# Altium schematic sheet Morpheus_pill.SchDoc: Pill
size Letter; DrawnBy: Dyke Shaffer; Organization: Hello Inc.; Revision: EVT2; SheetNumber: 1; SheetTotal: 4
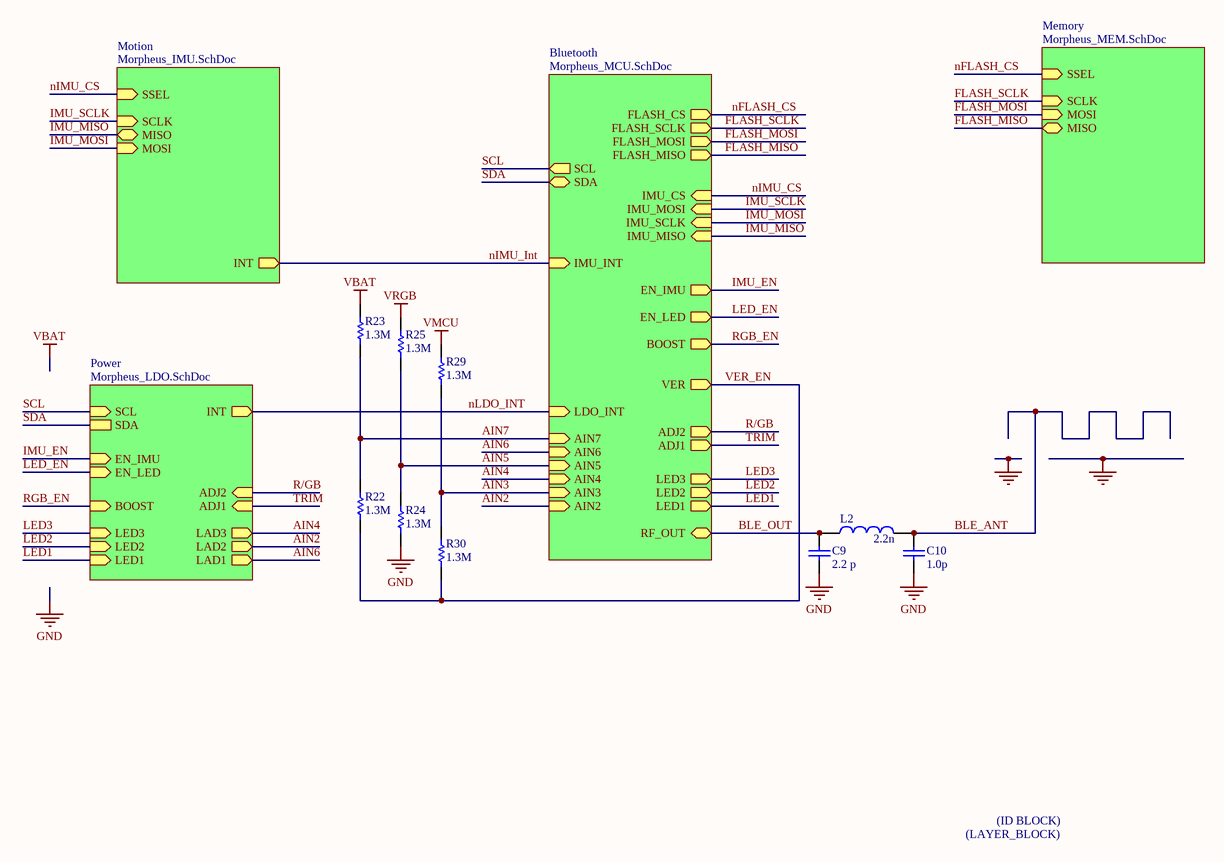
[diagram p0: Morpheus_pill.SchDoc]

## Parts
*  LAYER_BLOCK  [Layer Stackup]  (value not drawn)  (no BOM)
C9  2.2 p  [CAP0402]
C10  1.0p  [CAP0402]
ID1  ID_BLOCK  [Hello Band]  (value not drawn)  (no BOM)
L2  2.2n  [IND_0402]
R22  1.3M  [RES0402]
R23  1.3M  [RES0402]
R24  1.3M  [RES0402]
R25  1.3M  [RES0402]
R29  1.3M  [RES0402]
R30  1.3M  [RES0402]

## Sub-sheets
Bluetooth = Morpheus_MCU.SchDoc: FLASH_SCLK (out), FLASH_CS (out), IMU_INT (in), LED3 (out), EN_IMU (out), AIN6 (in), LDO_INT (in), SCL (out), SDA, AIN7 (in), EN_LED (out), AIN4 (in), AIN5 (in), AIN2 (in), AIN3 (in), RF_OUT, ADJ2 (out), ADJ1 (out), LED2 (out), LED1 (out), BOOST (out), VER (out), IMU_MISO (in), IMU_SCLK (in), IMU_MOSI (in), IMU_CS (in), FLASH_MOSI (out), FLASH_MISO (out)
Memory = Morpheus_MEM.SchDoc: SSEL (in), MOSI (in), MISO, SCLK (in)
Motion = Morpheus_IMU.SchDoc: MOSI (in), MISO, SCLK (in), INT (out), SSEL (in)
Power = Morpheus_LDO.SchDoc: SDA, INT (out), SCL (in), LAD3 (out), LAD2 (out), LAD1 (out), ADJ2 (in), EN_LED (in), EN_IMU (in), BOOST (in), ADJ1 (in), LED3 (in), LED2 (in), LED1 (in)

## Nets
GND: C9.2 C10.2 R24.1
VBAT: R23.2
VMCU: R29.2
VRGB: R25.2
AIN2: sheet Bluetooth/AIN2, sheet Power/LAD2
AIN3: R29.1 R30.2 ; sheet Bluetooth/AIN3
AIN4: sheet Bluetooth/AIN4, sheet Power/LAD3
AIN5: R24.2 R25.1 ; sheet Bluetooth/AIN5
AIN6: sheet Bluetooth/AIN6, sheet Power/LAD1
AIN7: R22.2 R23.1 ; sheet Bluetooth/AIN7
BLE_ANT: C10.1 L2.2
BLE_OUT: C9.1 L2.1 ; sheet Bluetooth/RF_OUT
FLASH_MISO: sheet Bluetooth/FLASH_MISO, sheet Memory/MISO
FLASH_MOSI: sheet Bluetooth/FLASH_MOSI, sheet Memory/MOSI
FLASH_SCLK: sheet Bluetooth/FLASH_SCLK, sheet Memory/SCLK
IMU_EN: sheet Bluetooth/EN_IMU, sheet Power/EN_IMU
IMU_MISO: sheet Bluetooth/IMU_MISO, sheet Motion/MISO
IMU_MOSI: sheet Bluetooth/IMU_SCLK, sheet Motion/MOSI
IMU_SCLK: sheet Bluetooth/IMU_MOSI, sheet Motion/SCLK
LED1: sheet Bluetooth/LED1, sheet Power/LED1
LED2: sheet Bluetooth/LED2, sheet Power/LED2
LED3: sheet Bluetooth/LED3, sheet Power/LED3
LED_EN: sheet Bluetooth/EN_LED, sheet Power/EN_LED
nFLASH_CS: sheet Bluetooth/FLASH_CS, sheet Memory/SSEL
nIMU_CS: sheet Bluetooth/IMU_CS, sheet Motion/SSEL
nIMU_Int: sheet Bluetooth/IMU_INT, sheet Motion/INT
nLDO_INT: sheet Bluetooth/LDO_INT, sheet Power/INT
R/GB: sheet Bluetooth/ADJ2, sheet Power/ADJ2
RGB_EN: sheet Bluetooth/BOOST, sheet Power/BOOST
SCL: sheet Bluetooth/SCL, sheet Power/SCL
SDA: sheet Bluetooth/SDA, sheet Power/SDA
TRIM: sheet Bluetooth/ADJ1, sheet Power/ADJ1
VER_EN: R22.1 R30.1 ; sheet Bluetooth/VER

## Notes on the sheet
- TITLE
- DATE
- DRAWN BY
- REV
- SHEET
- OF
- (in symbol ID_BLOCK) (ID BLOCK)
- (in symbol LAYER_BLOCK) (LAYER_BLOCK)

## Library data of the parts
C9 = C_2.2p_0.05_50_C0G_0402: Chip capacitor; Vendor: Murata; PN: GRM1555C1H2R2WA01D; Tolerance: 0.05; Voltage: 50 V; Temp: C0G; Value: 2.2 p; Size: 0402
C10 = C_2200p_5_16_STD_0402: Chip capacitor; Vendor: Taiyo Yuden; PN: EMK100SD222JV-F; Tolerance: 5 %; Voltage: 16V; Temp: Standard; Value: 1.0p; Size: 0402
L2 = L_2.2n_0.1_?_0.150_0.9_?: SMD power inductor, 2.2uH; PN: MLG1005S2N2BT000; Vendor: TDK; Tolerance: 0.1; RDC: 0.150; I_max: 0.9; Value: 2.2n; Q: ?; I_sat: ?
R22-R25 R29 R30 = R_1.3M_5_0.1_0402_1: Chip Resistor; Vendor: Panasonic; Tolerance: 5 %; Power: 0.1 W; PN: ERJ-2GEJ135X; Model: *; Value: 1.3M; Size: 0402